# EAGLE design DAC (EAGLE 6.3)
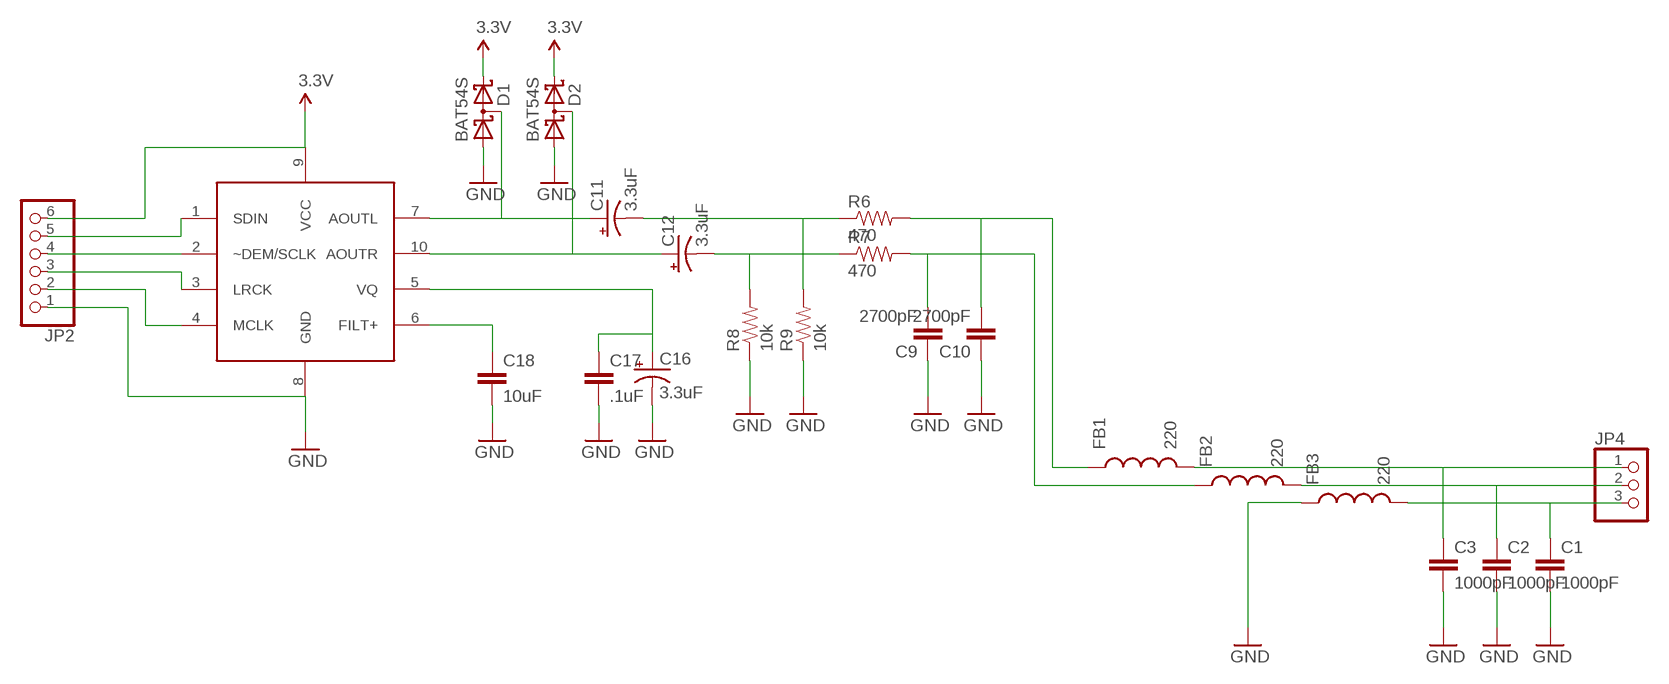
[diagram p0: schematic, sheet 1]

## Parts
C1  1000pF  CAP0402-CAP  [0402-CAP]
C2  1000pF  CAP0402-CAP  [0402-CAP]
C3  1000pF  CAP0402-CAP  [0402-CAP]
C9  2700pF  CAP0402-CAP  [0402-CAP]
C10  2700pF  CAP0402-CAP  [0402-CAP]
C11  3.3uF  CAP_POL1206  [EIA3216]
C12  3.3uF  CAP_POL1206  [EIA3216]
C16  3.3uF  CAP_POL1206  [EIA3216]
C17  .1uF  CAP0402-CAP  [0402-CAP]
C18  10uF  CAP0402-CAP  [0402-CAP]
D1  BAT54S  [SOT23]
D2  BAT54S  [SOT23]
FB1  220  INDUCTOR0805  [0805]
FB2  220  INDUCTOR0805  [0805]
FB3  220  INDUCTOR0805  [0805]
JP2  PINHD-1X6  [1X06]
JP4  PINHD-1X3  [1X03]
R6  470  RESISTOR0603-RES  [0603-RES]
R7  470  RESISTOR0603-RES  [0603-RES]
R8  10k  RESISTOR0603-RES  [0603-RES]
R9  10k  RESISTOR0603-RES  [0603-RES]
U$2  CS4344-DAC  [TSSOP-10]

## Nets
AOUTL: C3.1 FB1.2 JP4.1
AOUTL_C: C11.A(+) D1.3(C1A2) U$2.7(AOUTL)
AOUTL_FB: C10.2 FB1.1 R6.2
AOUTL_R: C11.C(-) R6.1 R9.2
AOUTR: C2.1 FB2.2 JP4.2
AOUTR_C: C12.A(+) D2.3(C1A2) U$2.10(AOUTR)
AOUTR_FB: C9.2 FB2.1 R7.2
AOUTR_R: C12.C(-) R7.1 R8.2
AOUTS: C1.1 FB3.2 JP4.3
FILT+: C18.1 U$2.6(FILT+)
GND: C1.2 C2.2 C3.2 C9.1 C10.1 C16.C(-) C17.2 C18.2 D1.1(A1) D2.1(A1) FB3.1 JP2.1 R8.1 R9.1 U$2.8(GND)
LRCLK: JP2.3 U$2.3(LRCK)
MCLK: JP2.2 U$2.4(MCLK)
SCLK: JP2.4 U$2.2(~DEM/SCLK)
SDIN: JP2.5 U$2.1(SDIN)
VCC: D1.2(C2) D2.2(C2) JP2.6 U$2.9(VCC) ; supply symbol labelled 3.3V
VQ: C16.A(+) C17.1 U$2.5(VQ)

## Library data of the parts
C1-C3 C9 C10 C17 C18 = 1x05smd:CAP: Capacitor Standard 0603 ceramic capacitor, and 0.1" leaded capacitor.
C11 C12 C16 = 1x05smd:CAP_POL: Capacitor Polarized These are standard SMD and PTH capacitors. Normally 10uF, 47uF, and 100uF in electrolytic and tantalum varieties. Always verify the external diameter of the through hole cap, it varies with capacity, voltage, and manufacturer. The EIA devices should be standard.
D1 D2 = diode:BAT54S: Schottky Diodes Pin connection corrected 2011-05-04 Source: Fairchild .. BAT54.pdf
FB1-FB3 = SparkFun-Passives:INDUCTOR: Inductors Basic Inductor/Choke - 0603 and 1206. Footprints are not proven and vary greatly between part numbers.
JP2 = adafruit:PINHD-1X6: PIN HEADER
JP4 = adafruit:PINHD-1X3: PIN HEADER
R6-R9 = 1x05smd:RESISTOR: Resistor Basic schematic elements and footprints for 0603, 1206, and PTH 1/10th watt (small) resistors.
U$2 = Strutz Electronic Industries:CS4344-DAC

## Board
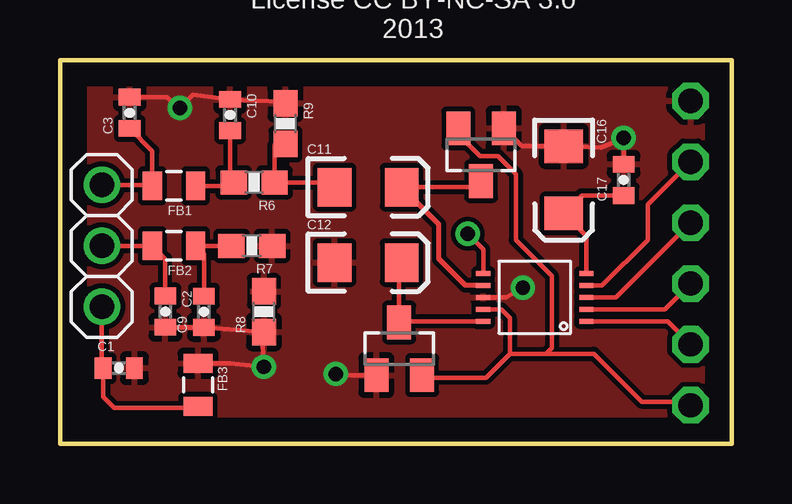
[diagram p1: board, top side]
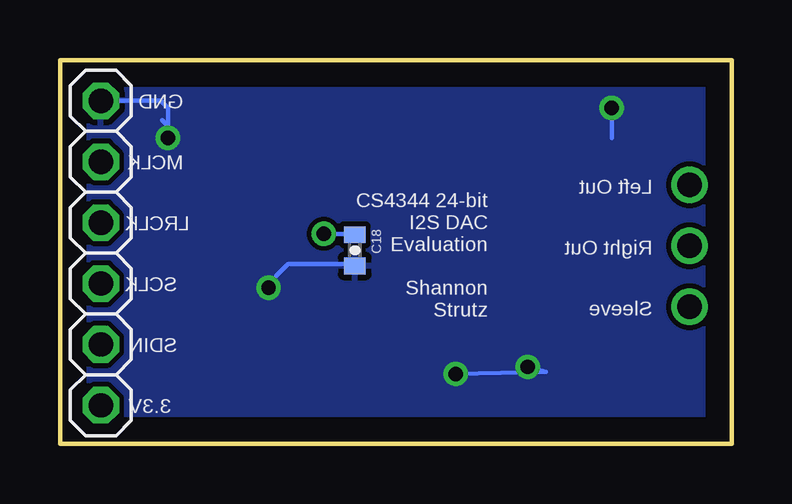
[diagram p2: board, bottom side, seen from below]

Size 28 x 16 mm. Coordinates in mm from the lower left corner, seen from the top.
Outline: 0,0 28,0 28,16 0,16 0,0
Copper layers (1*16): Top 0.035mm / dielectric 0.2mm / Bottom 0.035mm
Design rules "default *": minimum track width 10mil, minimum drill 24mil, track to track 8mil, track to pad 8mil, pad to pad 8mil, via to via 8mil, smd to smd 8mil, copper to edge 40mil, drill to drill 8mil, minimum pad ring 10mil, minimum via ring 8mil, stop-mask expansion 4mil, vias tented up to drill 0mil, thermal gap 10mil

### Footprints (pad centres in the part's own frame; a part is rotated, then mirrored left to right if it is on the bottom)
0402-CAP = smd 0.7 x 0.9: 1 -0.65,0; 2 0.65,0
EIA3216 = smd 1.4 x 1.6: A 1.4,0; C -1.4,0
SOT23 = smd 1 x 1.4: 1 -0.95,-1.1; 2 0.95,-1.1; 3 0,1.1
0805 = smd 0.8 x 1.2: 1 -0.9,0; 2 0.9,0
1X06 = drill 1.016 octagon: 1 -6.35,0; 2 -3.81,0; 3 -1.27,0; 4 1.27,0; 5 3.81,0; 6 6.35,0
1X03 = drill 1.016: 1 -2.54,0; 2 0,0; 3 2.54,0
0603-RES = smd 1.1 x 1: 1 -0.85,0; 2 0.85,0
TSSOP-10 = smd 0.6 x 0.2: 1 -2.15,1; 2 -2.15,0.5; 3 -2.15,0; 4 -2.15,-0.5; 5 -2.15,-1; 6 2.15,-1; 7 2.15,-0.5; 8 2.15,0; 9 2.15,0.5; 10 2.15,1

### Placement (x,y rotation side)
C1  2.45,3.15 0 top
C2  4.4,5.5 270 top
C3  2.9,13.8 90 top
C9  6,5.5 90 top
C10  7.1,13.7 270 top
C11  12.85,10.7 0 top
C12  12.85,7.55 0 top
C16  21,11 270 top
C17  23.5,11 90 top
C18  15.71,8.06 270 bottom
D1  17.55,12.05 180 top
D2  14.15,3.95 0 top
FB1  4.75,10.75 180 top
FB2  4.75,8.25 180 top
FB3  5.75,2.45 270 top
JP2  26.3,7.95 270 bottom
JP4  1.75,8.25 270 top
R6  8.1,10.9 180 top
R7  8,8.25 180 top
R8  8.5,5.5 90 top
R9  9.4,13.35 270 top
U$2  19.8,6.1 180 top

### Tracks (layer width: path | path; a pad name or v marks a point on that pad's centre or on a via)
AOUTL
  Top 0.178: JP4.1 3.81,10.79 FB1.2 3.85,12.2 C3.1
AOUTL_C
  Top 0.178: C11.A 17.3,10.7 D1.3
  Top 0.203: U$2.7 16.91,6.59 15.8,7.7 15.8,9.14 C11.A
AOUTL_FB
  Top 0.178: FB1.1 7.1,10.75 R6.2 7.09,11.05 C10.2
AOUTL_R
  Top 0.178: C11.C 11.25,10.89 R6.1 8.95,12.45 R9.2
AOUTR
  Top 0.178: JP4.2 FB2.2 4.39,7.71 C2.1
AOUTR_C
  Top 0.178: U$2.10 14.19,5.09 D2.3 14.14,7.44 C12.A
AOUTR_FB
  Top 0.178: C9.2 6,7.9 FB2.1 R7.2
AOUTR_R
  pour Top: 8,6 12.25,6 12.25,9 8.25,9 8.25,7 8,7
AOUTS
  Top 0.178: JP4.3 1.75,3.21 C1.1 1.8,1.95 2.25,1.5 5.71,1.5 FB3.2
FILT+  (via drill 0.6)
  Top 0.178: U$2.6 17.65,8.1 v17,8.75
  Bottom 0.178: v17,8.75 15.75,8.75 C18.1
GND  (via drill 0.6)
  Top 0.178: FB3.1 7.1,3.35 v8.5,3.2 8.4,4.65 | 8.4,4.65 C9.1 C2.2 | R8.1 8.4,4.65 | D2.1 12.15,2.85 v11.5,2.9 | C3.2 4.45,14.45 v5,14 5.55,14.55 C10.1 9.26,14.25 R9.1 | U$2.8 18.59,6.09 v19.3,6.5 | C17.2 v23.5,12.75 22.55,12.35 C16.C 19.25,12.4 D1.1
  Bottom 0.178: v11.5,2.9 7.75,3 v8.5,3.2 | v5,14 5,12.75 | v19.3,6.5 19,7 18.5,7.5 15.8,7.5 C18.2 | 23.75,13.5 23.5,13.25 v23.5,12.75 23.5,14 23.8,14.29 JP2.1
  pour Bottom: 0,0 28,0 28,16 0,16
  pour Top: 0,0 28,0 28,16 0,16
LRCLK
  Top 0.178: U$2.3 23.18,6.09 JP2.3
MCLK
  Top 0.178: U$2.4 22.59,6.59 24.5,8.5 24.5,9.96 JP2.2
SCLK
  Top 0.178: U$2.2 25.22,5.59 JP2.4
SDIN
  Top 0.178: U$2.1 25.34,5.09 JP2.5
VCC
  Top 0.178: U$2.9 18.41,5.59 18.75,5.25 18.75,3.75 | 18.75,3.75 17.75,2.75 15.2,2.75 D2.2 | 18.75,3.75 20.25,3.75 | 20.25,3.75 22.25,3.75 24.25,1.75 26.14,1.75 JP2.6 | D1.2 16.61,12.89 17.5,12 18.25,12 19,11.25 19,8.5 20.5,7 20.5,4 20.25,3.75
VQ
  Top 0.178: U$2.5 21.95,8.65 C16.A 21.75,10.35 C17.1

### Text on the board
_tsilk: Designed by Shannon Strutz / License CC BY-NC-SA 3.0 / 2013
_bsilk: GND | MCLK | Left Out | CS4344 24-bit / I2S DAC / Evaluation / / Shannon / Strutz | LRCLK | Right Out | SCLK | Sleeve | SDIN | 3.3V